# Altium schematic sheet Reference.SchDoc
size A; SheetNumber: 6; SheetTotal: 6
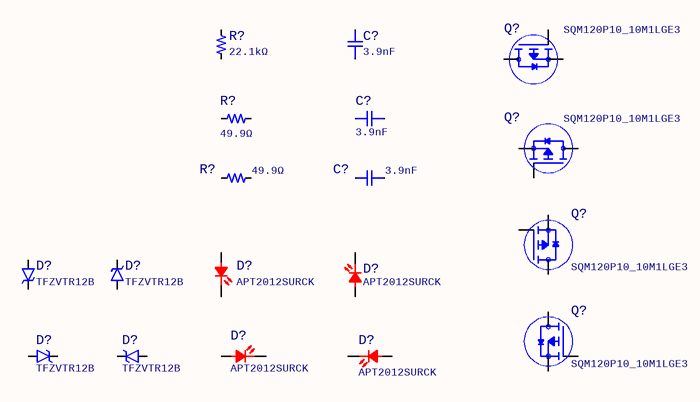
[diagram p0: Reference.SchDoc]

## Parts
(Parts that share a designator on the sheet are numbered #1, #2 ... from top to bottom, then left to right.)
C?#1  Capacitance: 3.9nF  [CAPC0805(2012)145_L]  (hidden comment: MN-CAP-CERM-C0G-0805-3.9nF-50V-5%)
C?#2  Capacitance: 3.9nF  [CAPC0805(2012)145_L]  (hidden comment: MN-CAP-CERM-C0G-0805-3.9nF-50V-5%)
C?#3  Capacitance: 3.9nF  [CAPC0805(2012)145_L]  (hidden comment: MN-CAP-CERM-C0G-0805-3.9nF-50V-5%)
D?#1  PartNumber: APT2012SURCK  [LEDC2012X05N]  (hidden comment: MN-LED-0805-RED)
D?#2  PartNumber: TFZVTR12B  [SOD-323HE]  (hidden comment: MN-DIO-ZENER-12V)
D?#3  PartNumber: TFZVTR12B  [SOD-323HE]  (hidden comment: MN-DIO-ZENER-12V)
D?#4  PartNumber: APT2012SURCK  [LEDC2012X05N]  (hidden comment: MN-LED-0805-RED)
D?#5  PartNumber: TFZVTR12B  [SOD-323HE]  (hidden comment: MN-DIO-ZENER-12V)
D?#6  PartNumber: TFZVTR12B  [SOD-323HE]  (hidden comment: MN-DIO-ZENER-12V)
D?#7  PartNumber: APT2012SURCK  [LEDC2012X05N]  (hidden comment: MN-LED-0805-RED)
D?#8  PartNumber: APT2012SURCK  [LEDC2012X05N]  (hidden comment: MN-LED-0805-RED)
Q?#1  PartNumber: SQM120P10_10M1LGE3  [FP-T13-0707-MFG]  (hidden comment: MN-TRN-MOSFET-P_CH-100V-120A-SQM120P10_10M1LGE3)
Q?#2  PartNumber: SQM120P10_10M1LGE3  [FP-T13-0707-MFG]  (hidden comment: MN-TRN-MOSFET-P_CH-100V-120A-SQM120P10_10M1LGE3)
Q?#3  PartNumber: SQM120P10_10M1LGE3  [FP-T13-0707-MFG]  (hidden comment: MN-TRN-MOSFET-P_CH-100V-120A-SQM120P10_10M1LGE3)
Q?#4  PartNumber: SQM120P10_10M1LGE3  [FP-T13-0707-MFG]  (hidden comment: MN-TRN-MOSFET-P_CH-100V-120A-SQM120P10_10M1LGE3)
R?#1  Resistance: 22.1kΩ  [RESC0402(1005)]  (hidden comment: MN-RES-0402-22.1KΩ-1/10W)
R?#2  Resistance: 49.9Ω  [RESC0402(1005)]  (hidden comment: MN-RES-0402-49.9Ω-1/16W)
R?#3  Resistance: 49.9Ω  [RESC0402(1005)]  (hidden comment: MN-RES-0402-49.9Ω-1/16W)

## Nets

Not connected (* = marked no-connect by the designer): C?#1 1 2; C?#2 1 2; C?#3 1 2; D?#1 A K; D?#2 1(K) 2(A); D?#3 1(K) 2(A); D?#4 A K; D?#5 1(K) 2(A); D?#6 1(K) 2(A); D?#7 A K; D?#8 A K; Q?#1 D G S; Q?#2 D G S; Q?#3 D G S; Q?#4 D G S; R?#1 1 2; R?#2 1 2; R?#3 1 2

## Library data of the parts
C?#1-C?#3 = CMP-001-00091-10: CAP, CERM, 3.9 nF, 50 V, +/-5%, 0805, C0G; PartNumber: CGA4C2C0G1H392J060AA; Value: 3.9nF; Dielectric Material: Ceramic; Tolerance: 5%; Voltage Rating: 50V; Case Code (Imperial): 0805; Case Code (Metric): 2012; Case/Package: 0805; Dielectric: C0G; Height: 600µm; Length: 2mm; Material: Ceramic; Mounting Technology: Surface Mount; Thickness: 711.2µm; Width: 1.25mm
D?#1 D?#4 D?#7 D?#8 = CMP-039-000000-9: LED Uni-Color Red 645nm 2-Pin Chip 0805(2012Metric) T/R; Viewing Angle: 120°; Wavelength: 635nm; Forward Voltage: 2.5V; Luminous Intensity: 150mcd; Power Rating: 75mW; Lens Style: Clear; Peak Wavelength: 650nm; Forward Current: 30mA; Illumination Color: Red; Terminal Pitch: 2.35mm; Length: 2mm; Case Code (Imperial): 0805; Case/Package: 0805; Width: 1.25mm; Height: 750µm; Color: Red; Case Code (Metric): 2012; Mounting Technology: Surface Mount
D?#2 D?#3 D?#5 D?#6 = CMP-039-000002-6: TFZVTR12B Series 12 V 500 mW Surface Mount Zener Diode - TUMD2M; Reference Voltage: 12V; Max Power Dissipation: 500mW; Zener Current: 10mA; Voltage Tolerance: 2.51%; Impedance: 12Ω; Pins: 2; Zener Voltage: 12V; Max Operating Temperature: 150°C; Mounting Technology: Surface Mount; Case/Package: SMD/SMT
Q?#1-Q?#4 = CMP-044-000000-5: Trans MOSFET P-CH 100V 120A Automotive AEC-Q101 3-Pin(2+Tab) D2PAK; Drain to Source Resistance: 8.1mΩ; Drain to Source Voltage (Vdss): -100V; Max Junction Temperature (Tj): 175°C; Turn-Off Delay Time: 120ns; Gate to Source Voltage (Vgs): 20V; Turn-On Delay Time: 20ns; Power Dissipation: 375W; Continuous Drain Current (ID): -120A; Min Operating Temperature: -55°C; Case/Package: D2PAK; Height: 5.08mm; Max Operating Temperature: 175°C; Pins: 3; Drain to Source Breakdown Voltage: -100V
R?#1 = CMP-009-00190-8: Resistor, 22.1KΩ, 1%, 1/10W (100mW), 0402; PartNumber: CRCW040222K1FKED; Power Rating: 63mW; Voltage Rating: 50V; Value: 22.1kΩ; Case Code (Imperial): 0402; Case Code (Metric): 1005; Case/Package: 0402; Composition: Thick Film; Height: 350µm; Length: 1mm; Mounting Technology: Surface Mount; Tolerance: 1%; Width: 500µm
R?#2 R?#3 = CMP-009-00191-8: Resistor, 49.9Ω, 1%, 1/16W (66mW), 0402; PartNumber: CRCW040249R9FKED; Voltage Rating: 50V; Power Rating: 63mW; Height: 350µm; Value: 49.9Ω; Width: 500µm; Mounting Technology: Surface Mount; Case Code (Imperial): 0402; Case Code (Metric): 1005; Length: 1mm; Tolerance: 1%; Composition: Thick Film; Case/Package: 0402